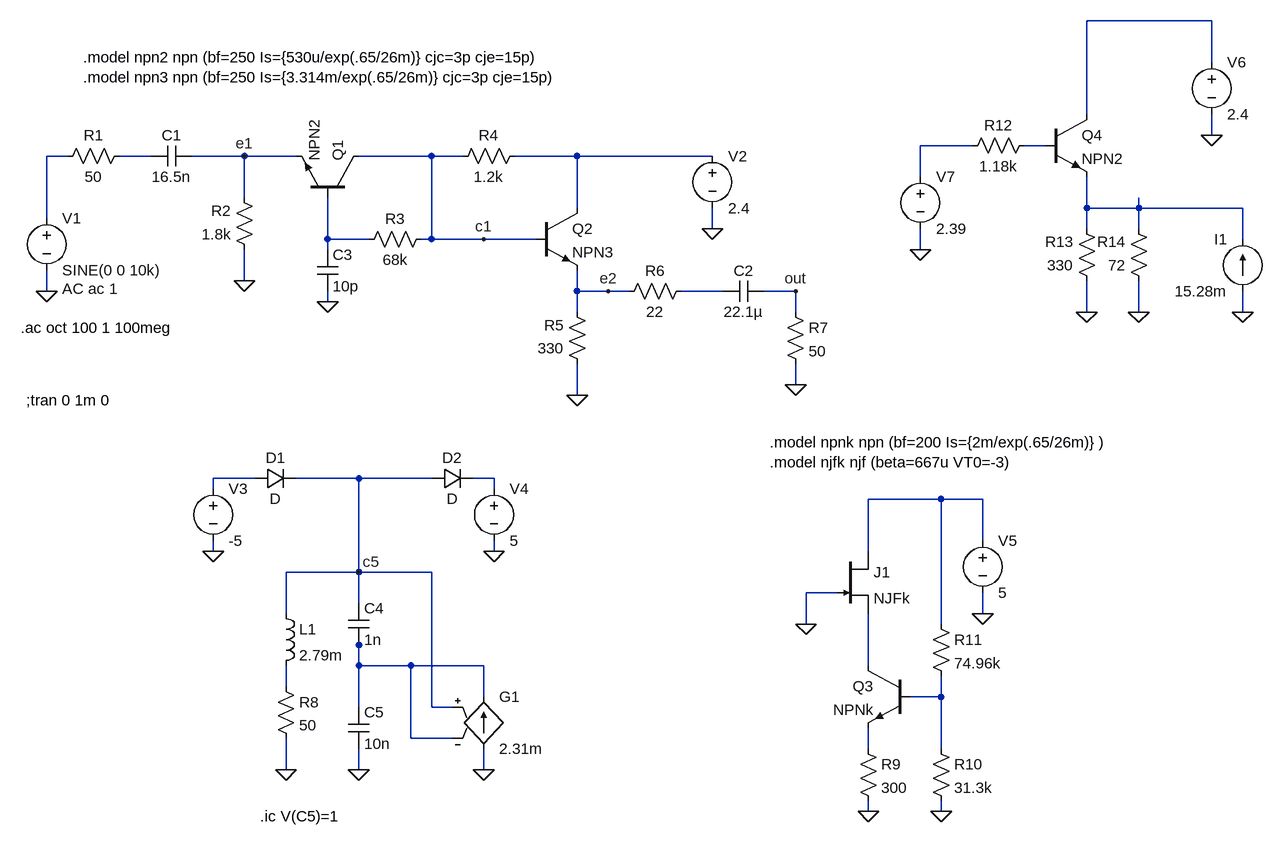
[diagram p0: schematic ss2013_antennenverst.asc]
ss2013_antennenverst.asc, the LTspice schematic file:
Version 4
SHEET 1 2148 1432
WIRE 2048 192 1856 192
WIRE 2048 256 2048 192
WIRE 1856 336 1856 192
WIRE 2048 368 2048 336
WIRE 1680 384 1600 384
WIRE 1792 384 1760 384
WIRE 288 400 256 400
WIRE 416 400 368 400
WIRE 560 400 480 400
WIRE 640 400 560 400
WIRE 848 400 736 400
WIRE 896 400 848 400
WIRE 1072 400 976 400
WIRE 1280 400 1072 400
WIRE 1600 432 1600 384
WIRE 560 464 560 400
WIRE 1072 480 1072 400
WIRE 1856 480 1856 432
WIRE 1936 480 1936 464
WIRE 1936 480 1856 480
WIRE 2096 480 1936 480
WIRE 256 496 256 400
WIRE 1280 512 1280 480
WIRE 1856 512 1856 480
WIRE 1936 512 1936 480
WIRE 688 528 688 464
WIRE 752 528 688 528
WIRE 848 528 848 400
WIRE 848 528 832 528
WIRE 928 528 848 528
WIRE 1008 528 928 528
WIRE 2096 528 2096 480
WIRE 688 544 688 528
WIRE 1600 544 1600 512
WIRE 560 592 560 544
WIRE 256 608 256 576
WIRE 1072 608 1072 576
WIRE 1120 608 1072 608
WIRE 1152 608 1120 608
WIRE 1296 608 1232 608
WIRE 1408 608 1360 608
WIRE 688 624 688 608
WIRE 1072 640 1072 608
WIRE 1408 640 1408 608
WIRE 1856 640 1856 592
WIRE 1936 640 1936 592
WIRE 2096 640 2096 608
WIRE 1408 752 1408 720
WIRE 1072 768 1072 720
WIRE 576 896 512 896
WIRE 736 896 640 896
WIRE 848 896 736 896
WIRE 944 896 912 896
WIRE 512 912 512 896
WIRE 944 912 944 896
WIRE 1632 928 1520 928
WIRE 1696 928 1632 928
WIRE 1696 992 1696 928
WIRE 512 1008 512 992
WIRE 944 1008 944 992
WIRE 1520 1008 1520 928
WIRE 736 1040 736 896
WIRE 736 1040 624 1040
WIRE 848 1040 736 1040
WIRE 1472 1072 1424 1072
WIRE 736 1088 736 1040
WIRE 624 1104 624 1040
WIRE 1696 1104 1696 1072
WIRE 1424 1120 1424 1072
WIRE 1632 1120 1632 928
WIRE 736 1152 736 1136
WIRE 736 1184 736 1152
WIRE 816 1184 736 1184
WIRE 928 1184 816 1184
WIRE 1520 1184 1520 1104
WIRE 624 1216 624 1184
WIRE 928 1232 928 1184
WIRE 1632 1232 1632 1200
WIRE 1632 1232 1584 1232
WIRE 736 1248 736 1184
WIRE 848 1248 848 1040
WIRE 880 1248 848 1248
WIRE 816 1296 816 1184
WIRE 880 1296 816 1296
WIRE 1520 1312 1520 1280
WIRE 1632 1312 1632 1232
WIRE 624 1344 624 1296
WIRE 736 1344 736 1312
WIRE 928 1344 928 1312
WIRE 1520 1408 1520 1392
WIRE 1632 1408 1632 1392
FLAG 1408 752 0
FLAG 1072 768 0
FLAG 256 608 0
FLAG 560 592 0
FLAG 688 624 0
FLAG 1280 512 0
FLAG 1408 608 out
FLAG 1120 608 e2
FLAG 928 528 c1
FLAG 560 400 e1
FLAG 928 1344 0
FLAG 736 1344 0
FLAG 624 1344 0
FLAG 736 1040 c5
FLAG 944 1008 0
FLAG 512 1008 0
FLAG 1696 1104 0
FLAG 1520 1408 0
FLAG 1632 1408 0
FLAG 1424 1120 0
FLAG 2048 368 0
FLAG 2096 640 0
FLAG 1936 640 0
FLAG 1856 640 0
FLAG 1600 544 0
SYMBOL voltage 256 480 R0
WINDOW 123 24 124 Left 2
WINDOW 39 0 0 Left 2
SYMATTR Value2 AC ac 1
SYMATTR InstName V1
SYMATTR Value SINE(0 0 10k)
SYMBOL cap 480 384 R90
WINDOW 0 0 32 VBottom 2
WINDOW 3 32 32 VTop 2
SYMATTR InstName C1
SYMATTR Value 16.5n
SYMBOL res 384 384 R90
WINDOW 0 0 56 VBottom 2
WINDOW 3 32 56 VTop 2
SYMATTR InstName R1
SYMATTR Value 50
SYMBOL res 576 560 R180
WINDOW 0 36 76 Left 2
WINDOW 3 36 40 Left 2
SYMATTR InstName R2
SYMATTR Value 1.8k
SYMBOL npn 736 464 M270
SYMATTR InstName Q1
SYMATTR Value NPN2
SYMBOL npn 1008 480 R0
SYMATTR InstName Q2
SYMATTR Value NPN3
SYMBOL res 848 512 R90
WINDOW 0 0 56 VBottom 2
WINDOW 3 32 56 VTop 2
SYMATTR InstName R3
SYMATTR Value 68k
SYMBOL res 992 384 R90
WINDOW 0 0 56 VBottom 2
WINDOW 3 32 56 VTop 2
SYMATTR InstName R4
SYMATTR Value 1.2k
SYMBOL res 1088 736 R180
WINDOW 0 36 76 Left 2
WINDOW 3 36 40 Left 2
SYMATTR InstName R5
SYMATTR Value 330
SYMBOL res 1136 624 R270
WINDOW 0 32 56 VTop 2
WINDOW 3 0 56 VBottom 2
SYMATTR InstName R6
SYMATTR Value 22
SYMBOL cap 1360 592 R90
WINDOW 0 0 32 VBottom 2
WINDOW 3 32 32 VTop 2
SYMATTR InstName C2
SYMATTR Value 22.1µ
SYMBOL res 1392 624 R0
SYMATTR InstName R7
SYMATTR Value 50
SYMBOL cap 672 544 R0
SYMATTR InstName C3
SYMATTR Value 10p
SYMBOL voltage 1280 384 R0
WINDOW 123 0 0 Left 2
WINDOW 39 0 0 Left 2
SYMATTR InstName V2
SYMATTR Value 2.4
SYMBOL g 928 1216 R0
SYMATTR InstName G1
SYMATTR Value 2.31m
SYMBOL cap 720 1088 R0
SYMATTR InstName C4
SYMATTR Value 1n
SYMBOL cap 720 1248 R0
SYMATTR InstName C5
SYMATTR Value 10n
SYMBOL ind 608 1088 R0
SYMATTR InstName L1
SYMATTR Value 2.79m
SYMBOL res 608 1200 R0
SYMATTR InstName R8
SYMATTR Value 50
SYMBOL voltage 512 896 R0
WINDOW 123 0 0 Left 2
WINDOW 39 0 0 Left 2
SYMATTR InstName V3
SYMATTR Value -5
SYMBOL voltage 944 896 R0
WINDOW 123 0 0 Left 2
WINDOW 39 0 0 Left 2
SYMATTR InstName V4
SYMATTR Value 5
SYMBOL diode 576 912 R270
WINDOW 0 32 32 VTop 2
WINDOW 3 0 32 VBottom 2
SYMATTR InstName D1
SYMBOL diode 848 912 R270
WINDOW 0 32 32 VTop 2
WINDOW 3 0 32 VBottom 2
SYMATTR InstName D2
SYMBOL njf 1472 1008 R0
SYMATTR InstName J1
SYMATTR Value NJFk
SYMBOL voltage 1696 976 R0
WINDOW 123 0 0 Left 2
WINDOW 39 0 0 Left 2
SYMATTR InstName V5
SYMATTR Value 5
SYMBOL npn 1584 1184 M0
SYMATTR InstName Q3
SYMATTR Value NPNk
SYMBOL res 1504 1296 R0
SYMATTR InstName R9
SYMATTR Value 300
SYMBOL res 1616 1296 R0
SYMATTR InstName R10
SYMATTR Value 31.3k
SYMBOL res 1616 1104 R0
SYMATTR InstName R11
SYMATTR Value 74.96k
SYMBOL npn 1792 336 R0
SYMATTR InstName Q4
SYMATTR Value NPN2
SYMBOL res 1776 368 R90
WINDOW 0 0 56 VBottom 2
WINDOW 3 32 56 VTop 2
SYMATTR InstName R12
SYMATTR Value 1.18k
SYMBOL res 1872 608 R180
WINDOW 0 36 76 Left 2
WINDOW 3 36 40 Left 2
SYMATTR InstName R13
SYMATTR Value 330
SYMBOL res 1952 608 R180
WINDOW 0 36 76 Left 2
WINDOW 3 36 40 Left 2
SYMATTR InstName R14
SYMATTR Value 72
SYMBOL current 2096 608 R180
WINDOW 0 24 80 Left 2
WINDOW 3 24 0 Left 2
WINDOW 123 0 0 Left 2
WINDOW 39 0 0 Left 2
SYMATTR InstName I1
SYMATTR Value 15.28m
SYMBOL voltage 2048 240 R0
SYMATTR InstName V6
SYMATTR Value 2.4
SYMBOL voltage 1600 416 R0
SYMATTR InstName V7
SYMATTR Value 2.39
TEXT 312 248 Left 2 !.model npn2 npn (bf=250 Is={530u/exp(.65/26m)} cjc=3p cje=15p)\n.model npn3 npn (bf=250 Is={3.314m/exp(.65/26m)} cjc=3p cje=15p)
TEXT 224 776 Left 2 !;tran 0 1m 0
TEXT 584 1416 Left 2 !.ic V(C5)=1
TEXT 1368 840 Left 2 !.model npnk npn (bf=200 Is={2m/exp(.65/26m)} )\n.model njfk njf (beta=667u VT0=-3)
TEXT 216 664 Left 2 !.ac oct 100 1 100meg

The netlist it stands for:
* ss2013_antennenverst.asc
V1 N004 0 SINE(0 0 10k) AC ac 1
C1 e1 N005 16.5n
R1 N005 N004 50
R2 0 e1 1.8k
Q1 c1 N008 e1 0 NPN2
Q2 N006 c1 e2 0 NPN3
R3 c1 N008 68k
R4 N006 c1 1.2k
R5 0 e2 330
R6 e2 N009 22
C2 out N009 22.1µ
R7 out 0 50
C3 N008 0 10p
V2 N006 0 2.4
G1 0 N013 c5 N013 2.31m
C4 c5 N013 1n
C5 N013 0 10n
L1 c5 N015 2.79m
R8 N015 0 50
V3 N010 0 -5
V4 N011 0 5
D1 N010 c5 D
D2 c5 N011 D
J1 N012 0 N014 NJFk
V5 N012 0 5
Q3 N014 N016 N017 0 NPNk
R9 N017 0 300
R10 N016 0 31.3k
R11 N012 N016 74.96k
Q4 N001 N003 N007 0 NPN2
R12 N003 N002 1.18k
R13 0 N007 330
R14 0 N007 72
I1 0 N007 15.28m
V6 N001 0 2.4
V7 N002 0 2.39
.model D D
.lib standard.dio
.model NPN NPN
.model PNP PNP
.lib standard.bjt
.model NJF NJF
.model PJF PJF
.lib standard.jft
.model npn2 npn (bf=250 Is={530u/exp(.65/26m)} cjc=3p cje=15p)
.model npn3 npn (bf=250 Is={3.314m/exp(.65/26m)} cjc=3p cje=15p)
;tran 0 1m 0
.ic V(C5)=1
.model npnk npn (bf=200 Is={2m/exp(.65/26m)} )
.model njfk njf (beta=667u VT0=-3)
.ac oct 100 1 100meg
.backanno
.end